# EAGLE design MC146818_WiFi (EAGLE 7.7.0)
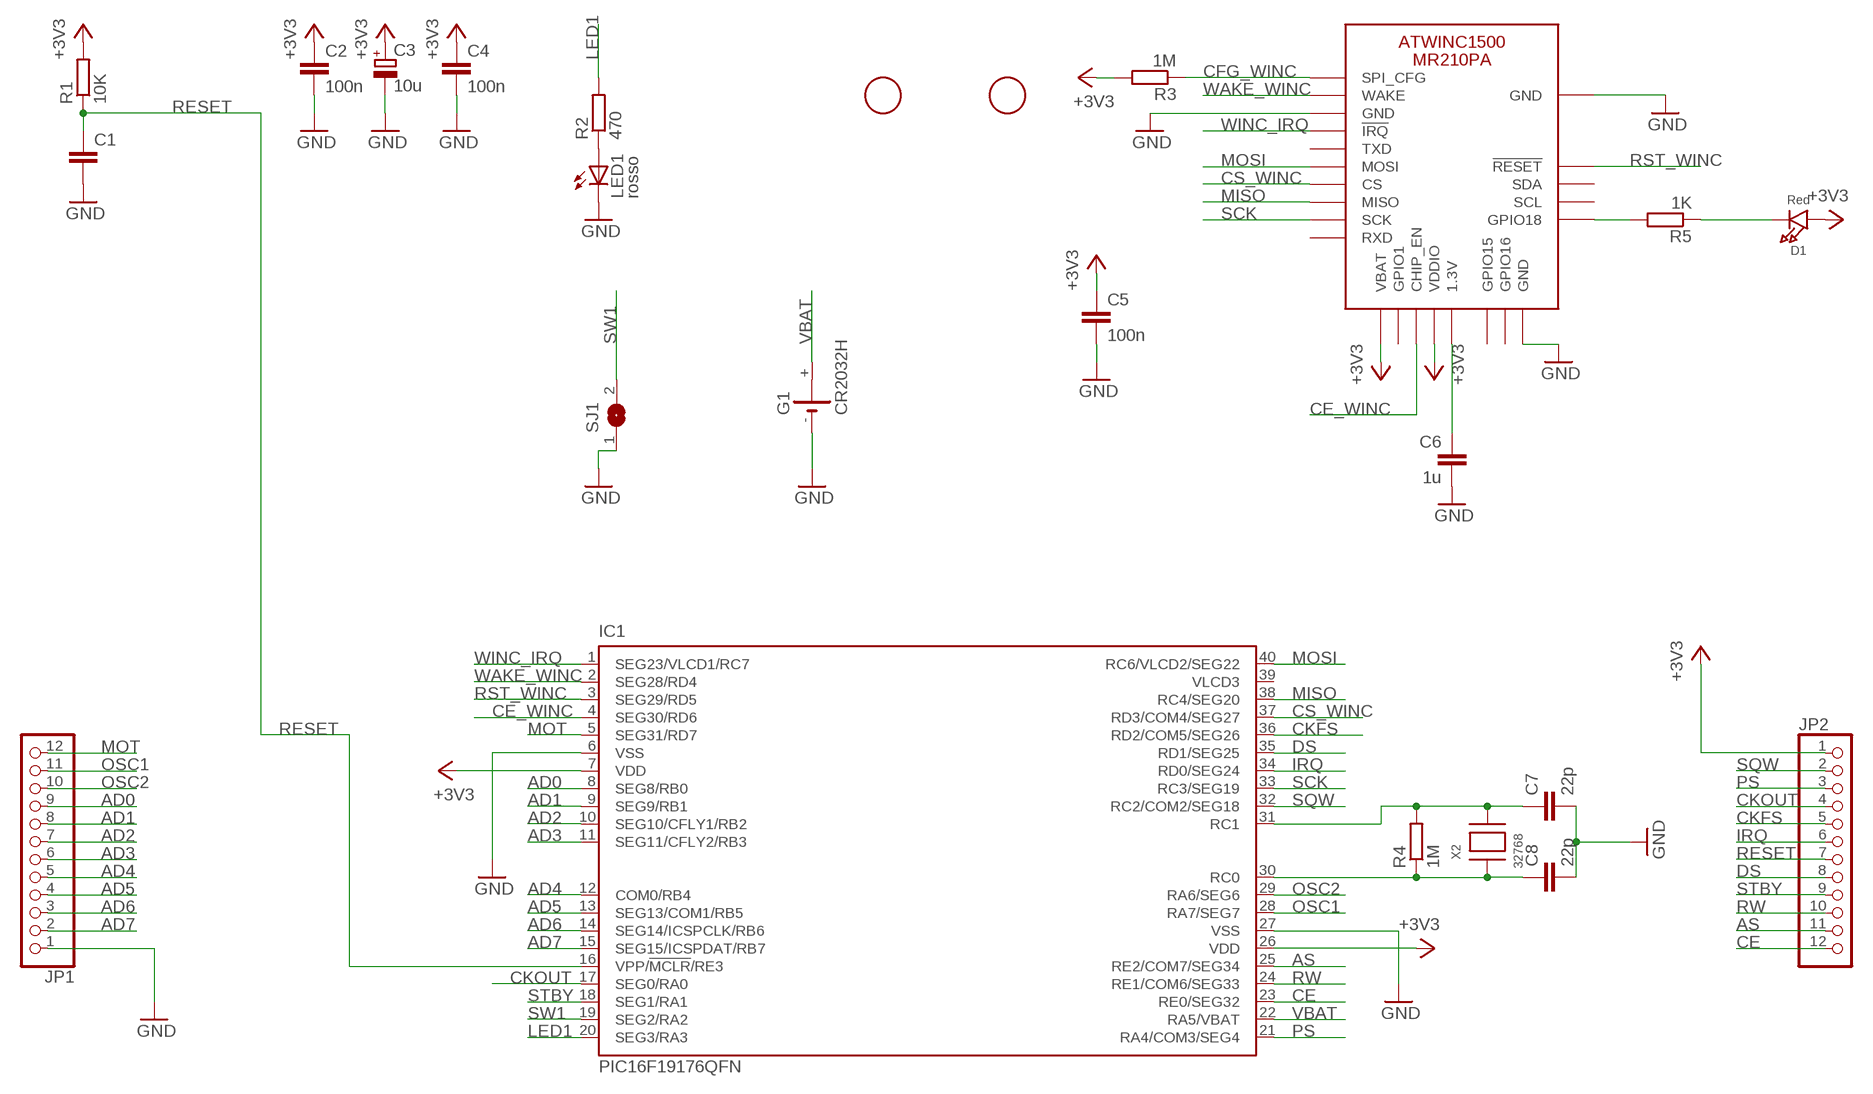
[diagram p0: schematic, sheet 1]

## Parts
C1  C-EUC0603  [C0603]
C2  100n  C-EUC0603  [C0603]
C3  10u  CPOL-EUSMCZ  [SMC_Z]
C4  100n  C-EUC0603  [C0603]
C5  100n  C-EUC0603  [C0603]
C6  1u  C-EUC0805  [C0805]
C7  22p  C-EUC0603  [C0603]
C8  22p  C-EUC0603  [C0603]
D1  Red  LED0805_NOOUTLINE  [CHIPLED_0805_NOOUTLINE]
F1  FIDUCIAL  [FIDUCIAL_1MM]
F2  FIDUCIAL  [FIDUCIAL_1MM]
G1  CR2032H  [CR2032H]
IC1  PIC16F19176QFN  [UQFN40ML5X5MM]
JP1  PINHD-1X12_2.54  [1X12]
JP2  PINHD-1X12_2.54  [1X12]
LED1  rosso  LEDCHIPLED_0805  [CHIPLED_0805]
R1  10K  R-EU_R0603  [R0603]
R2  470  R-EU_R0603  [R0603]
R3  1M  R-EU_R0603  [R0603]
R4  1M  R-EU_R0603  [R0603]
R5  1K  R-EU_R0603  [R0603]
SJ1  SJ  [SJ]
X1  ATWINC1500_MR210PB  ATWINC1500_MR210PA  [ATWINC1500_MR210PA]
X2  32768  XTAL-3.2X1.5  [XTAL3215]

## Nets
+3V3: C2.1 C3.+ C4.1 C5.1 D1.A IC1.7(VDD) IC1.26(VDD) JP2.1 R1.2 R3.2 X1.J20(VBAT) X1.J23(VDDIO)
AD0: IC1.8(SEG8/RB0) JP1.9
AD1: IC1.9(SEG9/RB1) JP1.8
AD2: IC1.10(SEG10/CFLY1/RB2) JP1.7
AD3: IC1.11(SEG11/CFLY2/RB3) JP1.6
AD4: IC1.12(COM0/RB4) JP1.5
AD5: IC1.13(SEG13/COM1/RB5) JP1.4
AD6: IC1.14(SEG14/ICSPCLK/RB6) JP1.3
AD7: IC1.15(SEG15/ICSPDAT/RB7) JP1.2
AS: IC1.25(RE2/COM7/SEG34) JP2.11
CE: IC1.23(RE0/SEG32) JP2.12
CE_WINC [N3]: IC1.4(SEG30/RD6) X1.J22(CHIP_EN)
CFG_WINC: R3.1 X1.J10(SPI_CFG)
CKFS: IC1.36(RD2/COM5/SEG26) JP2.5
CKOUT: IC1.17(SEG0/RA0) JP2.4
CS_WINC: IC1.37(RD3/COM4/SEG27) X1.J16(CS)
DS: IC1.35(RD1/SEG25) JP2.8
GND: C1.2 C2.2 C3.- C4.2 C5.2 C6.2 C7.2 C8.2 G1.- IC1.6(VSS) IC1.27(VSS) JP1.1 LED1.C SJ1.1 X1.J9(GND) X1.J12(GND) X1.J28(GND) X1.MTGND(GND)
IRQ: IC1.34(RD0/SEG24) JP2.6
LED1: IC1.20(SEG3/RA3) R2.2
MISO: IC1.38(RC4/SEG20) X1.J17(MISO)
MOSI: IC1.40(RC6/VLCD2/SEG22) X1.J15(MOSI)
MOT: IC1.5(SEG31/RD7) JP1.12
N$1: LED1.A R2.1
N$11: R5.2 X1.J1(GPIO18)
N$12: D1.C R5.1
N$19: C6.1 X1.J24(1.3V)
OSC1: IC1.28(RA7/SEG7) JP1.11
OSC2: IC1.29(RA6/SEG6) JP1.10
PS: IC1.21(RA4/COM3/SEG4) JP2.3
RESET: C1.1 IC1.16(VPP/!MCLR!/RE3) JP2.7 R1.1
RST_WINC: IC1.3(SEG29/RD5) X1.J4(!RESET)
RW: IC1.24(RE1/COM6/SEG33) JP2.10
SCK: IC1.33(RC3/SEG19) X1.J18(SCK)
SOSCI: C8.1 IC1.30(RC0) R4.1 X2.P$1
SOSCO: C7.1 IC1.31(RC1) R4.2 X2.P$2
SQW: IC1.32(RC2/COM2/SEG18) JP2.2
STBY: IC1.18(SEG1/RA1) JP2.9
SW1: IC1.19(SEG2/RA2) SJ1.2
VBAT: G1.+ IC1.22(RA5/VBAT)
WAKE_WINC: IC1.2(SEG28/RD4) X1.J11(WAKE)
WINC_IRQ: IC1.1(SEG23/VLCD1/RC7) X1.J13(!IRQ)
Unconnected: G1.+@1(+) IC1.39(VLCD3) X1.J2(SCL) X1.J3(SDA) X1.J14(TXD) X1.J19(RXD) X1.J21(GPIO1) X1.J26(GPIO15) X1.J27(GPIO16)

## Library data of the parts
C1 C2 C4-C8 = resistor:C-EU: CAPACITOR, European symbol
C3 = resistor:CPOL-EU: POLARIZED CAPACITOR, European symbol
D1 = microbuilder:LED: LED
F1 F2 = adafruit:FIDUCIAL: For use by pick and place machines to calibrate the vision/machine, 1mm By microbuilder.eu
G1 = battery:CR2032H: LI BATTERY Varta
IC1 = microchip2:PIC16F19176QFN: Flash-Based, 8-Bit CMOS Microcontrollers wtih LCD Driver and nanoWatt XLP Technology Source: http://ww1.microchip.com/downloads/en/DeviceDoc/41364D.pdf
JP1 JP2 = pinhead-2:PINHD-1X12: PIN HEADER
LED1 = led:LED: LED
R1-R5 = resistor:R-EU_: RESISTOR, European symbol
SJ1 = jumper:SJ: SMD solder JUMPER
X1 = microbuilder:ATWINC1500_MR210PA: ATWINC1500_MR210PA wifi module
X2 = adafruit:XTAL: Low cost SMT crystals, no capacitors included http://www.ladyada.net/library/eagle

## Net classes
1 +3V3: width 0.33 mm, clearance 0.152 mm
2 N2: width 0.33 mm, clearance 0.762 mm
3 N3: width 0.33 mm
4 GND: width 0.305 mm, clearance 0.152 mm

## Board
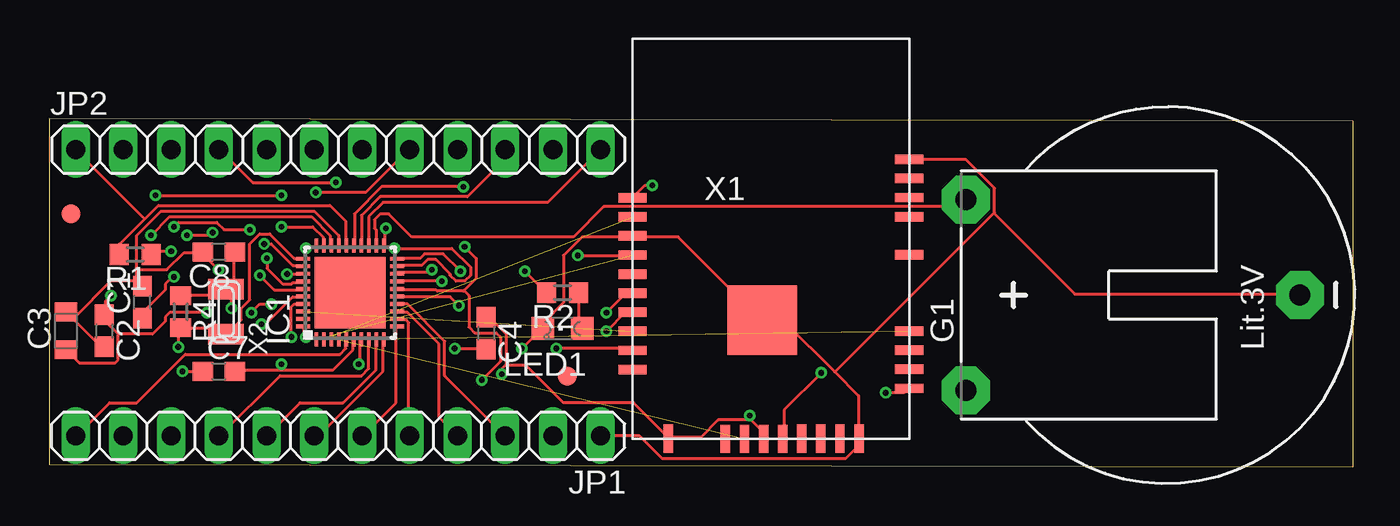
[diagram p1: board, top side]
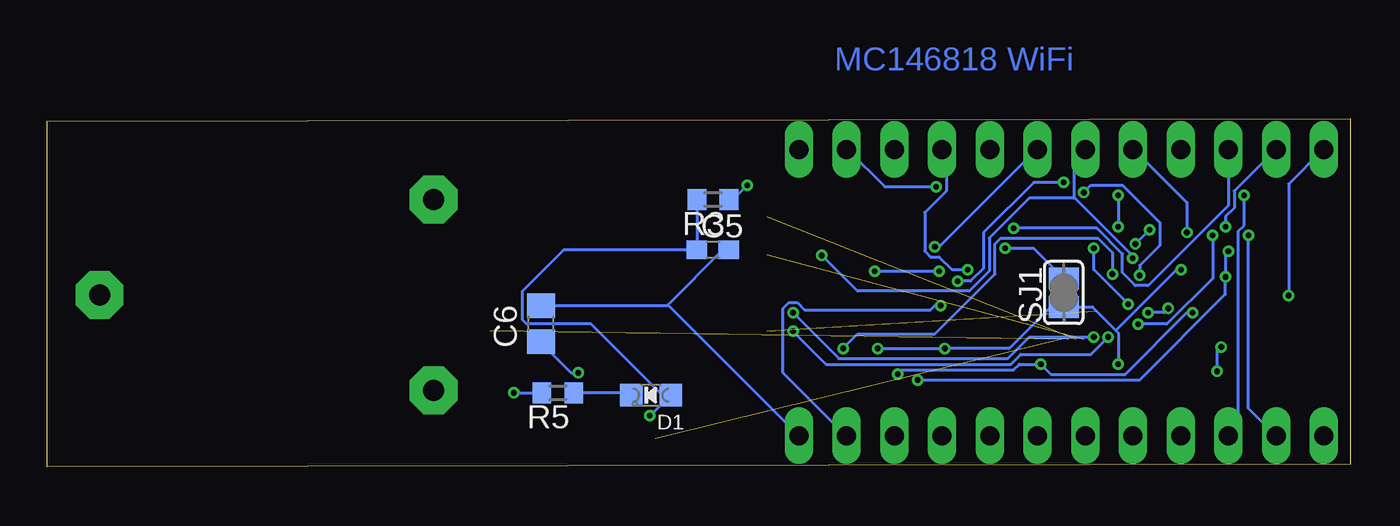
[diagram p2: board, bottom side, seen from below]

Size 69.34 x 18.53 mm. Coordinates in mm from the lower left corner, seen from the top.
Outline: 0,0.13 69.34,0 69.34,18.4 0,18.53 0,0.13
Copper layers (1*16): Top 0.035mm / dielectric 1.5mm / Bottom 0.035mm
Design rules "SeeedStudio_2layer_DRU_no_angle_20140221": minimum track width 6mil, minimum drill 12mil, track to track 6mil, track to pad 6mil, pad to pad 6mil, via to via 6mil, smd to smd 0mil, copper to edge 10mil, drill to drill 10mil, minimum pad ring 10mil, minimum via ring 6mil, stop-mask expansion 2mil, vias tented up to drill 100mil, thermal gap 10mil

### Footprints (pad centres in the part's own frame; a part is rotated, then mirrored left to right if it is on the bottom)
C0603 = smd 1.1 x 1: 1 -0.85,0; 2 0.85,0
SMC_Z = smd 1 x 1.2: + -1,0; - 1,0
C0805 = smd 1.3 x 1.5: 1 -0.95,0; 2 0.95,0
CHIPLED_0805_NOOUTLINE = smd 1.2 x 1.2: A 0,-1.05; C 0,1.05
FIDUCIAL_1MM = smd 1 x 1: 1 0,0
CR2032H = drill 1.118 pad 2.54 octagon: + 5.08,10.795; +@1 -5.08,10.795; - 0,-6.985
UQFN40ML5X5MM = smd 0.75 x 0.2: 1 -2.5,1.8; 2 -2.5,1.4; 3 -2.5,1; 4 -2.5,0.6; 5 -2.5,0.2; 6 -2.5,-0.2; 7 -2.5,-0.6; 8 -2.5,-1; 9 -2.5,-1.4; 10 -2.5,-1.8; 21 2.5,-1.8; 22 2.5,-1.4; 23 2.5,-1; 24 2.5,-0.6; 25 2.5,-0.2; 26 2.5,0.2; 27 2.5,0.6; 28 2.5,1; 29 2.5,1.4; 30 2.5,1.8 | smd 0.2 x 0.75: 11 -1.8,-2.5; 12 -1.4,-2.5; 13 -1,-2.5; 14 -0.6,-2.5; 15 -0.2,-2.5; 16 0.2,-2.5; 17 0.6,-2.5; 18 1,-2.5; 19 1.4,-2.5; 20 1.8,-2.5; 31 1.8,2.5; 32 1.4,2.5; 33 1,2.5; 34 0.6,2.5; 35 0.2,2.5; 36 -0.2,2.5; 37 -0.6,2.5; 38 -1,2.5; 39 -1.4,2.5; 40 -1.8,2.5 | smd 3.8 x 3.8: TH 0,0
1X12 = drill 1.016 long: 1 -13.97,0; 2 -11.43,0; 3 -8.89,0; 4 -6.35,0; 5 -3.81,0; 6 -1.27,0; 7 1.27,0; 8 3.81,0; 9 6.35,0; 10 8.89,0; 11 11.43,0; 12 13.97,0
CHIPLED_0805 = smd 1.2 x 1.2: A 0,-1.05; C 0,1.05
R0603 = smd 1 x 1.1: 1 -0.85,0; 2 0.85,0
SJ = smd 1.168 x 1.6: 1 -0.762,0; 2 0.762,0
ATWINC1500_MR210PA = smd 1.5 x 0.5: J1 7.146,-4.973; J2 7.146,-3.957; J3 7.146,-2.941; J4 7.146,-1.925; J5 7.146,2.139; J6 7.146,4.171; J7 7.146,5.187; J8 7.146,6.203; J9 7.146,7.219; J10 -7.584,5.181; J11 -7.584,4.165; J12 -7.584,3.149; J13 -7.584,2.133; J14 -7.584,1.117; J15 -7.584,0.101; J16 -7.584,-0.915; J17 -7.584,-1.931; J18 -7.584,-2.947; J19 -7.584,-3.963 | smd 0.5 x 1.5: J20 -5.684,-7.643; J21 -2.636,-7.663; J22 -1.62,-7.663; J23 -0.604,-7.663; J24 0.412,-7.663; J25 1.428,-7.643; J26 2.444,-7.643; J27 3.46,-7.643; J28 4.476,-7.643 | smd 3.7 x 3.7: MTGND -0.666,-1.331
XTAL3215 = smd 1.1 x 1.9: P$1 1.2,0; P$2 -1.2,0

### Placement (x,y rotation side)
C1  4.95,8.76 90 top
C2  2.92,7.24 270 top
C3  0.89,7.24 90 top
C4  23.24,7.11 270 top
C5  33.91,11.56 0 bottom
C6  43.05,7.62 90 bottom
C7  9.02,5.08 0 top
C8  9.02,11.43 180 top
D1  37.21,3.81 90 bottom
F1  1.14,13.46 0 top
F2  27.56,4.83 0 top
G1  59.56,9.14 90 top
IC1  16,9.27 90 top
JP1  15.37,1.65 180 top
JP2  15.37,16.89 0 top
LED1  27.3,7.37 90 top
R1  4.57,11.3 180 top
R2  27.3,9.27 180 top
R3  33.91,14.22 180 bottom
R4  6.99,8.26 270 top
R5  42.16,3.94 180 bottom
SJ1  15.24,9.27 90 bottom
X1  38.61,9.14 0 top
X2  9.4,8.26 90 top

### Tracks (layer width: path | path; a pad name or v marks a point on that pad's centre or on a via)
+3V3  (via drill 0.3)
  Top 0.152: 5.07,13.2 3.73,11.86 3.73,11.33 R1.2 | 5.07,13.2 5.79,13.92 14.94,13.92 15.77,13.08 15.77,11.79 IC1.26 | 3.66,7.06 2.97,7.75 2.97,8.05 C2.1 2.97,8.13 2.97,8.81 v3.28,9.12 | 3.66,7.06 3.66,5.69 3.5,5.54 1.6,5.54 0.91,6.22 C3.+ | 5.07,13.2 1.37,16.89 JP2.1 | v16.46,5.46 16.54,5.54 16.54,6.76 IC1.7 | v24.08,4.93 24.08,5.23 24.27,5.42 | 24.27,5.42 24.31,5.46 24.31,7.06 23.47,7.9 23.24,7.9 C4.1 | X1.J23 37.95,1.5 37.95,1.88 37.26,2.57 v37.26,2.72 37.26,2.49 35.59,2.49 34.67,1.57 32.99,1.57 X1.J20 32.92,1.57 31.09,3.4 27.36,3.4 25.38,5.38 24.31,5.38 24.27,5.42 | 3.66,7.06 5.49,7.06 6.17,7.75 6.17,7.98 6.4,8.2 v8.38,8.2
  Bottom 0.152: v3.28,9.12 3.28,15.06 1.45,16.89 JP2.1 | v24.08,4.93 23.85,5.16 17.91,5.16 17.6,5.46 v16.46,5.46 15.93,4.93 11.96,4.93 8.69,8.2 v8.38,8.2 | R3.2 34.75,14.22 34.75,11.56 C5.1 41.83,11.56 44.04,9.35 44.04,7.82 43.81,7.59 40.39,7.59 36.42,3.63 D1.A 36.2,3.79 v37.26,2.72
AD0
  Top 0.152: IC1.8 16.99,6.76 16.99,5.23 16.61,4.85 12.27,4.85 9.07,1.65 JP1.9
AD1
  Top 0.152: IC1.9 17.37,6.76 17.37,5.16 15.62,3.4 13.34,3.4 11.58,1.65 JP1.8
AD2
  Top 0.152: JP1.7 14.33,1.65 17.75,5.08 17.75,6.76 IC1.10
AD3
  Top 0.152: IC1.11 18.44,7.44 18.44,3.4 16.69,1.65 JP1.6
AD4
  Top 0.152: IC1.12 18.52,7.82 18.97,7.82 19.13,7.67 19.13,1.65 JP1.5
AD5
  Top 0.152: JP1.4 20.73,2.64 20.73,6.53 19.05,8.2 18.52,8.2 IC1.13
AD6
  Top 0.152: IC1.14 18.52,8.66 19.05,8.66 21.03,6.68 21.03,4.85 24.23,1.65 JP1.3
AD7  (via drill 0.3)
  Top 0.152: v21.79,8.59 21.34,9.04 18.52,9.04 IC1.15
  Bottom 0.152: v21.79,8.59 22.1,8.59 22.33,8.36 29.03,8.36 29.41,8.74 29.87,8.74 30.18,8.43 30.18,5 26.82,1.65 JP1.2
AS  (via drill 0.3)
  Top 0.152: v22.02,14.91 17.68,14.91 16.23,13.46 16.23,11.79 IC1.25
  Bottom 0.152: v22.02,14.91 24.77,14.91 26.75,16.89 JP2.11
CE
  Top 0.152: JP2.12 26.52,14.07 17.75,14.07 16.99,13.31 16.99,11.79 IC1.23
CE_WINC  (1 unrouted)
CFG_WINC  (via drill 0.3)
  Top 0.152: v32.08,14.99 31.7,14.99 31.09,14.38 X1.J10
  Bottom 0.152: R3.1 32.84,14.22 v32.08,14.99
CKFS  (via drill 0.3)
  Top 0.152: v11.28,7.59 11.51,7.59 12.95,9.04 13.49,9.04 IC1.36 | v7.32,12.32 8.53,12.32 v8.69,12.47
  Bottom 0.152: v11.28,7.59 9.75,7.59 7.32,10.03 v7.32,12.32 | v8.69,12.47 8.69,14.07 11.51,16.89 JP2.5
CKOUT  (via drill 0.3)
  Top 0.152: v20.88,9.88 18.52,9.88 IC1.17 | v15.24,15.14 10.82,15.14 9.07,16.89 JP2.4
  Bottom 0.152: v20.88,9.88 20.19,9.88 19.51,10.57 19.51,12.47 16.84,15.14 v15.24,15.14
CS_WINC  (via drill 0.3)
  Top 0.152: v12.88,6.91 12.88,8.51 13.03,8.66 13.49,8.66 IC1.37 | v29.64,7.21 30.63,8.2 31.01,8.2 X1.J16
  Bottom 0.152: v12.88,6.91 13.79,5.99 17.53,5.99 18.06,5.46 27.89,5.46 v29.64,7.21
DS  (via drill 0.3)
  Top 0.152: v11.2,10.19 11.96,9.42 13.49,9.42 IC1.35 | v14.17,14.61 16.84,14.61 19.13,16.89 JP2.8
  Bottom 0.152: v11.2,10.19 11.2,10.72 10.13,11.79 10.13,13.01 12.12,14.99 13.79,14.99 v14.17,14.61
GND  (via drill 0.3)
  Top 0.152: C2.2 2.9,6.45 2.67,6.45 0.91,8.2 C3.- 1.29,7.9 3.28,9.88 4.65,9.88 C1.2 4.95,9.65 4.65,9.96 4.65,10.49 | 4.65,10.49 4.65,12.32 5.94,13.61 14.1,13.61 15.39,12.32 15.39,11.79 IC1.27 | 4.65,10.49 6.25,10.49 7.16,11.41 8.15,11.41 C8.2 8.15,11.33 v8.99,10.49 | 12.34,5.16 9.98,5.16 9.91,5.08 C7.2 | 12.34,5.16 15.09,5.16 16.15,6.22 16.15,6.76 IC1.6 | v21.57,6.3 23.24,6.3 C4.2 | v12.34,5.46 12.34,5.16 | 41.8,5.04 39.09,7.75 37.95,7.75 X1.MTGND 37.87,7.82 33.45,12.24 31.09,12.24 X1.J12 31.01,12.24 28.35,12.24 27.36,11.25 27.36,8.74 26.29,7.67 26.29,7.37 LED1.C 26.21,7.37 v25.15,6.3 | 41.8,5.04 43.05,3.79 43.05,1.57 X1.J28 43.05,1.5 43.05,1.12 42.37,0.43 32.61,0.43 31.39,1.65 JP1.1 | 41.8,5.04 50.25,13.5 | 50.25,13.5 50.29,13.54 50.29,14.83 48.77,16.36 45.8,16.36 X1.J9 | 50.25,13.5 54.56,9.2 66.52,9.2 G1.-
  Bottom 0.152: C5.2 33.38,11.56 36.31,8.62 | 36.31,8.62 36.35,8.59 43.05,8.59 C6.2 | 36.31,8.62 JP1.1 | v12.34,5.46 12.34,7.14 12.46,7.25 | 12.46,7.25 13.72,8.51 SJ1.1 15.93,8.51 18.14,6.3 v21.57,6.3 v25.15,6.3 | v8.99,10.49 9.22,10.49 12.46,7.25
IRQ  (via drill 0.3)
  Top 0.152: v11.58,11.1 11.58,10.57 12.42,9.73 12.88,9.73 12.95,9.8 13.49,9.8 IC1.34 | v28.12,11.25 31.01,11.25
  Bottom 0.152: v11.58,11.1 11.58,11.25 14.67,14.34 | 14.67,14.34 14.71,14.38 14.71,16.28 JP2.6 | v28.12,11.25 26.21,9.35 20.27,9.35 19.2,10.41 19.2,12.17 17.07,14.3 14.71,14.3 14.67,14.34
LED1  (via drill 0.3)
  Top 0.152: v21.87,10.41 20.95,11.33 19.96,11.33 19.74,11.1 18.52,11.1 IC1.20 | v25.3,10.41 R2.2
  Bottom 0.152: v25.3,10.41 v21.87,10.41
MISO  (1 unrouted)
MOSI  (via drill 0.3)
  Top 0.152: v13.64,6.91 13.56,6.98 13.56,7.44 IC1.40 | v29.64,8.2 30.63,9.2 31.01,9.2 X1.J15
  Bottom 0.152: v13.64,6.91 17.07,6.91 18.21,5.77 27.2,5.77 v29.64,8.2
MOT
  Top 0.152: IC1.5 15.77,6.76 15.77,6.3 15.47,5.99 7.24,5.99 4.65,3.4 3.2,3.4 1.45,1.65 JP1.12
N$1
  Top 0.152: R2.1 28.19,9.27 28.19,7.52 28.35,7.37 LED1.A
N$11  (via drill 0.3)
  Top 0.152: v44.5,3.94 45.49,3.94 45.72,4.17 X1.J1
  Bottom 0.152: v44.5,3.94 R5.2
N$12
  Bottom 0.152: R5.1 38.41,3.94 38.33,3.86 D1.C
N$19  (via drill 0.3)
  Top 0.152: v41.07,5 39.09,3.02 39.09,1.5 X1.J24
  Bottom 0.152: v41.07,5 41.45,5 43.05,6.6 C6.1
OSC1  (via drill 0.3)
  Top 0.152: v5.41,12.32 6.4,13.31 13.95,13.31 14.94,12.32 14.94,11.79 IC1.28
  Bottom 0.152: v5.41,12.32 5.41,3.1 3.96,1.65 JP1.11
OSC2  (via drill 0.3)
  Top 0.152: v12.34,12.78 14.02,12.78 14.55,12.24 14.55,11.79 IC1.29 | v5.64,14.45 v12.34,14.45
  Bottom 0.152: v12.34,14.45 v12.34,12.78 | v5.64,14.45 5.64,12.85 5.94,12.55 5.94,2.18 JP1.10
PS  (via drill 0.3)
  Top 0.152: v17.91,12.7 17.83,12.62 17.83,11.79 IC1.21
  Bottom 0.152: v17.91,12.7 13.49,12.7 12.12,11.33 12.12,10.34 11.43,9.65 10.74,9.65 6.48,13.92 JP2.3
RESET  (via drill 0.3)
  Top 0.152: C1.1 4.95,8.2 6.17,9.42 6.17,9.73 6.55,10.11 v6.63,10.11 | v6.48,11.48 5.64,11.48 5.49,11.33 R1.1 | 22.06,9.38 22.71,10.03 22.71,11.1 v22.1,11.71 | 22.06,9.38 22.02,9.35 20.65,9.35 20.57,9.42 18.52,9.42 IC1.16 | v23.01,4.62 24,5.61 24,6.91 23.77,7.14 22.63,7.14 22.33,7.44 22.33,9.12 22.06,9.38
  Bottom 0.152: v6.48,11.48 6.63,11.33 v6.63,10.11 6.63,9.2 11.2,4.62 v23.01,4.62 | v22.1,11.71 21.87,11.71 16.69,16.89 JP2.7
RST_WINC  (1 unrouted)
RW
  Top 0.152: IC1.24 16.61,11.79 16.61,13.39 17.6,14.38 22.25,14.38 24.23,16.36 24.23,16.89 JP2.10
SCK  (via drill 0.3)
  Top 0.152: v12.65,10.26 13.49,10.26 IC1.33 | v26.98,6.3 30.94,6.3 31.01,6.22 X1.J18
  Bottom 0.152: v12.65,10.26 12.65,11.41 13.41,12.17 18.59,12.17 18.9,11.86 18.9,10.26 22.1,7.06 26.21,7.06 v26.98,6.3
SOSCI  (via drill 0.3)
  Top 0.152: v13.64,11.63 13.72,11.71 14.17,11.71 IC1.30 | v11.81,8.66 11.2,8.66 v10.74,8.2 | v9.68,8.43 9.68,9.2 9.45,9.42 X2.P$1 | R4.1 7.01,9.12 9.07,9.12 9.37,9.42 X2.P$1 | C8.1 9.83,11.41 9.83,9.88 9.45,9.5 X2.P$1
  Bottom 0.152: v13.64,11.63 13.64,10.49 v11.81,8.66 | v10.74,8.2 9.91,8.2 v9.68,8.43
SOSCO  (via drill 0.3)
  Top 0.152: IC1.31 13.49,11.1 13.03,11.1 11.73,12.4 11.2,12.4 10.67,11.86 10.67,8.89 10.21,8.43 10.21,7.82 9.45,7.06 X2.P$2 9.37,7.06 9.07,7.37 7.01,7.37 R4.2 7.01,7.29 6.86,7.14 v6.86,6.38 | v7.09,5.08 C7.1
  Bottom 0.152: v7.09,5.08 7.09,6.15 v6.86,6.38
SQW  (via drill 0.3)
  Top 0.152: v11.43,11.86 11.81,11.86 12.95,10.72 13.49,10.72 IC1.32 | v10.67,12.62 9.3,12.62 8.91,13.01 6.86,13.01 v6.63,12.78
  Bottom 0.152: v10.67,12.62 v11.43,11.86 | v6.63,12.78 6.63,13.31 6.17,13.77 6.17,14.68 3.96,16.89 JP2.2
STBY  (via drill 0.3)
  Top 0.152: v20.34,10.49 20.19,10.34 18.52,10.34 IC1.18
  Bottom 0.152: v20.34,10.49 21.18,10.49 21.87,11.18 22.33,11.18 22.63,11.48 22.63,13.54 21.49,14.68 21.49,16.66 JP2.9
SW1  (via drill 0.3)
  Top 0.152: v18.36,11.63 21.41,11.63 22.4,10.64 22.4,10.19 22.1,9.88 21.64,9.88 21.34,10.19 21.34,10.26 20.57,11.02 20.12,11.02 19.81,10.72 18.52,10.72 IC1.19
  Bottom 0.152: v18.36,11.63 16.84,11.63 SJ1.2
VBAT
  Top 0.152: G1.+ 48.39,13.84 29.49,13.84 27.89,12.24 19.28,12.24 18.06,13.46 17.6,13.46 17.3,13.16 17.3,12.7 17.37,12.62 17.37,11.79 IC1.22
WAKE_WINC  (1 unrouted)
WINC_IRQ  (1 unrouted)

### Text on the board
Bottom: MC146818 WiFi